# Altium schematic sheet config-bank7.SchDoc: Config FPGA - Bank 7
size Letter; CompanyName: Brinton Engineering, LLC; Address1: 3479 Edison Way; Address2: Menlo Park CA 94025; Address3: +1 (877) 778-8435; Address4: brintonengineering.com; Revision: 1; SheetNumber: 1; SheetTotal: 1
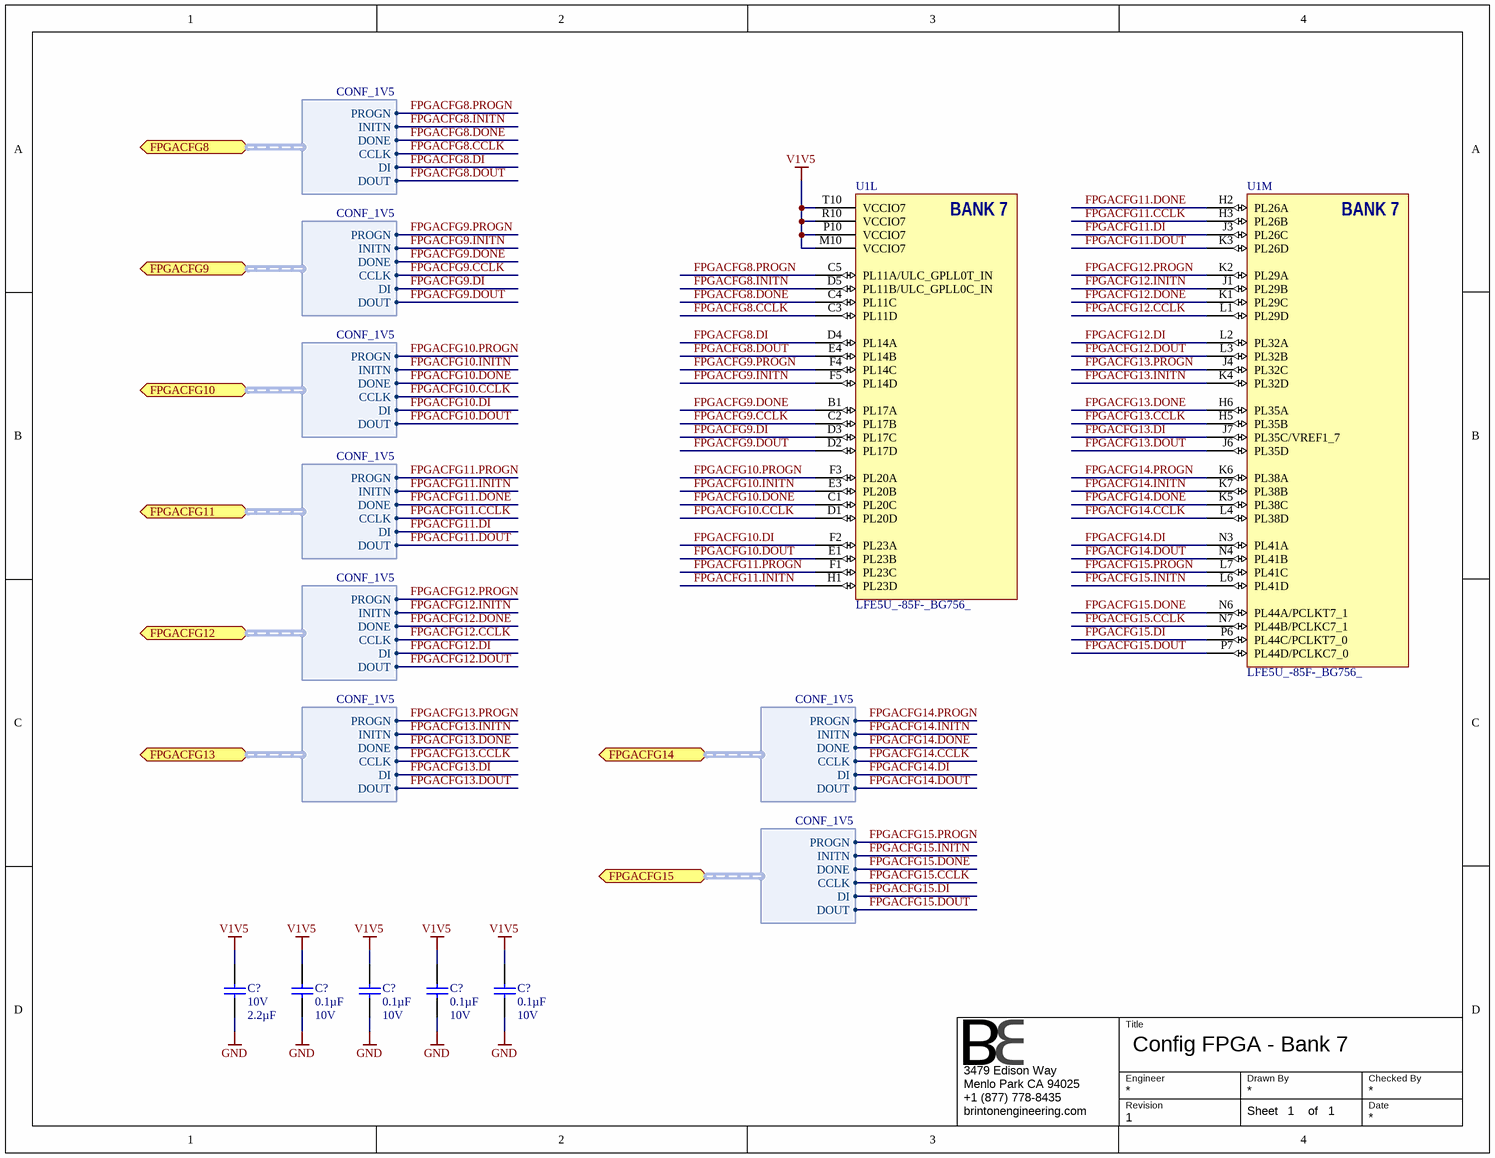
[diagram p0: config-bank7.SchDoc]

## Parts
(Parts that share a designator on the sheet are numbered #1, #2 ... from top to bottom, then left to right.)
C?#1  Voltage - Rated: 10V  Capacitance: 2.2µF  [CAPC1608X90N]  (hidden comment: GRM188R71A225KE15D)
C?#2  Capacitance: 0.1µF  Voltage - Rated: 10V  [CAPC1005X56N]  (hidden comment: GRM155R71A104KA01J)
C?#3  Capacitance: 0.1µF  Voltage - Rated: 10V  [CAPC1005X56N]  (hidden comment: GRM155R71A104KA01J)
C?#4  Capacitance: 0.1µF  Voltage - Rated: 10V  [CAPC1005X56N]  (hidden comment: GRM155R71A104KA01J)
C?#5  Capacitance: 0.1µF  Voltage - Rated: 10V  [CAPC1005X56N]  (hidden comment: GRM155R71A104KA01J)
U1  LFE5U_-85F-_BG756_  [caBGA756]  (parts L,M of 19)

## Ports
FPGACFG8 (harness CONF_1V5), FPGACFG9 (harness CONF_1V5), FPGACFG10 (harness CONF_1V5), FPGACFG11 (harness CONF_1V5), FPGACFG12 (harness CONF_1V5), FPGACFG13 (harness CONF_1V5), FPGACFG14 (harness CONF_1V5), FPGACFG15 (harness CONF_1V5)

## Harnesses
CONF_1V5: PROGN, INITN, DONE, CCLK, DI, DOUT

## Nets
GND: C?#1.1 C?#2.1 C?#3.1 C?#4.1 C?#5.1
V1V5: C?#1.2 C?#2.2 C?#3.2 C?#4.2 C?#5.2 U1.M10(VCCIO7) U1.P10(VCCIO7) U1.R10(VCCIO7) U1.T10(VCCIO7)
FPGACFG8.CCLK: U1.C3(PL11D) ; port FPGACFG8.CCLK
FPGACFG8.DI: U1.D4(PL14A) ; port FPGACFG8.DI
FPGACFG8.DONE: U1.C4(PL11C) ; port FPGACFG8.DONE
FPGACFG8.DOUT: U1.E4(PL14B) ; port FPGACFG8.DOUT
FPGACFG8.INITN: U1.D5(PL11B/ULC_GPLL0C_IN) ; port FPGACFG8.INITN
FPGACFG8.PROGN: U1.C5(PL11A/ULC_GPLL0T_IN) ; port FPGACFG8.PROGN
FPGACFG9.CCLK: U1.C2(PL17B) ; port FPGACFG9.CCLK
FPGACFG9.DI: U1.D3(PL17C) ; port FPGACFG9.DI
FPGACFG9.DONE: U1.B1(PL17A) ; port FPGACFG9.DONE
FPGACFG9.DOUT: U1.D2(PL17D) ; port FPGACFG9.DOUT
FPGACFG9.INITN: U1.F5(PL14D) ; port FPGACFG9.INITN
FPGACFG9.PROGN: U1.F4(PL14C) ; port FPGACFG9.PROGN
FPGACFG10.CCLK: U1.D1(PL20D) ; port FPGACFG10.CCLK
FPGACFG10.DI: U1.F2(PL23A) ; port FPGACFG10.DI
FPGACFG10.DONE: U1.C1(PL20C) ; port FPGACFG10.DONE
FPGACFG10.DOUT: U1.E1(PL23B) ; port FPGACFG10.DOUT
FPGACFG10.INITN: U1.E3(PL20B) ; port FPGACFG10.INITN
FPGACFG10.PROGN: U1.F3(PL20A) ; port FPGACFG10.PROGN
FPGACFG11.CCLK: U1.H3(PL26B) ; port FPGACFG11.CCLK
FPGACFG11.DI: U1.J3(PL26C) ; port FPGACFG11.DI
FPGACFG11.DONE: U1.H2(PL26A) ; port FPGACFG11.DONE
FPGACFG11.DOUT: U1.K3(PL26D) ; port FPGACFG11.DOUT
FPGACFG11.INITN: U1.H1(PL23D) ; port FPGACFG11.INITN
FPGACFG11.PROGN: U1.F1(PL23C) ; port FPGACFG11.PROGN
FPGACFG12.CCLK: U1.L1(PL29D) ; port FPGACFG12.CCLK
FPGACFG12.DI: U1.L2(PL32A) ; port FPGACFG12.DI
FPGACFG12.DONE: U1.K1(PL29C) ; port FPGACFG12.DONE
FPGACFG12.DOUT: U1.L3(PL32B) ; port FPGACFG12.DOUT
FPGACFG12.INITN: U1.J1(PL29B) ; port FPGACFG12.INITN
FPGACFG12.PROGN: U1.K2(PL29A) ; port FPGACFG12.PROGN
FPGACFG13.CCLK: U1.H5(PL35B) ; port FPGACFG13.CCLK
FPGACFG13.DI: U1.J7(PL35C/VREF1_7) ; port FPGACFG13.DI
FPGACFG13.DONE: U1.H6(PL35A) ; port FPGACFG13.DONE
FPGACFG13.DOUT: U1.J6(PL35D) ; port FPGACFG13.DOUT
FPGACFG13.INITN: U1.K4(PL32D) ; port FPGACFG13.INITN
FPGACFG13.PROGN: U1.J4(PL32C) ; port FPGACFG13.PROGN
FPGACFG14.CCLK: U1.L4(PL38D) ; port FPGACFG14.CCLK
FPGACFG14.DI: U1.N3(PL41A) ; port FPGACFG14.DI
FPGACFG14.DONE: U1.K5(PL38C) ; port FPGACFG14.DONE
FPGACFG14.DOUT: U1.N4(PL41B) ; port FPGACFG14.DOUT
FPGACFG14.INITN: U1.K7(PL38B) ; port FPGACFG14.INITN
FPGACFG14.PROGN: U1.K6(PL38A) ; port FPGACFG14.PROGN
FPGACFG15.CCLK: U1.N7(PL44B/PCLKC7_1) ; port FPGACFG15.CCLK
FPGACFG15.DI: U1.P6(PL44C/PCLKT7_0) ; port FPGACFG15.DI
FPGACFG15.DONE: U1.N6(PL44A/PCLKT7_1) ; port FPGACFG15.DONE
FPGACFG15.DOUT: U1.P7(PL44D/PCLKC7_0) ; port FPGACFG15.DOUT
FPGACFG15.INITN: U1.L6(PL41D) ; port FPGACFG15.INITN
FPGACFG15.PROGN: U1.L7(PL41C) ; port FPGACFG15.PROGN

## Notes on the sheet
- Title
- Engineer
- Revision
- Drawn By
- Checked By
- Date
- Sheet
- of
- (in symbol LFE5U_-85F-_BG756_, part L) BANK 7
- (in symbol LFE5U_-85F-_BG756_, part M) BANK 7

## Library data of the parts
C?#1 = GRM188R71A225KE15D: CAP CER 2.2UF 10V 10% X7R 0603; Manufacturer: Murata Electronics North America; Manufacturer P/N: GRM188R71A225KE15D; Operating Temperature: -55°C ~ 125°C; Thickness (Max): 0.035" (0.90mm); Tolerance: ±10%; Package / Case: 0603 (1608 Metric); Temperature Coefficient: X7R; Supplier 1: Newark; Supplier 2: Digi-Key; RoHS: RoHS Compliant; Size / Dimension: 0.063" L x 0.031" W (1.60mm x 0.80mm); Mounting Type: Surface Mount, MLCC; ComponentLink1URL: http://www.murata.com/~/media/webrenewal/support/library/catalog/products/capacitor/mlcc/c02e.ashx; ComponentLink1Description: http://www.murata.com/~/media/webrenewal/support/library/catalog/products/capacitor/mlcc/c02e.ashx; Supplier Part Number 1: 72R4209; Supplier Part Number 2: 490-4520-1-ND
C?#2-C?#5 = GRM155R71A104KA01J: CAP CER 0.1UF 10V 10% X7R 0402; Manufacturer: Murata Electronics North America; Manufacturer P/N: GRM155R71A104KA01J; Operating Temperature: -55°C ~ 125°C; Thickness (Max): 0.022" (0.55mm); Size / Dimension: 0.039" L x 0.020" W (1.00mm x 0.50mm); RoHS: RoHS Compliant; Mounting Type: Surface Mount, MLCC; Supplier 1: Digi-Key; ComponentLink1URL: http://www.murata.com/~/media/webrenewal/support/library/catalog/products/capacitor/mlcc/c02e.ashx; ComponentLink1Description: http://www.murata.com/~/media/webrenewal/support/library/catalog/products/capacitor/mlcc/c02e.ashx; Supplier Part Number 1: 490-6322-1-ND; Temperature Coefficient: X7R; Package / Case: 0402 (1005 Metric); Tolerance: ±10%
U1 = LFE5U_-85F-_BG756_: ECP5 FPGA, 85k LUT, 756-caBGA; Manufacturer: Lattice Semiconductor; Manufacturer P/N: LFE5U_-85F-_BG756_